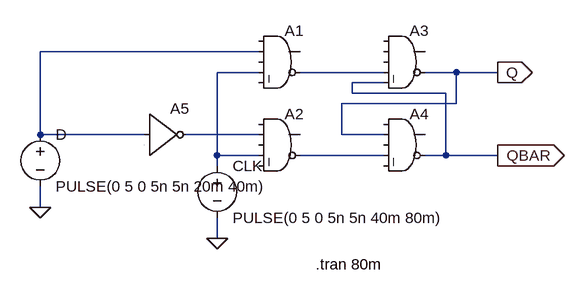
[diagram p0: schematic DFFUSINGNAND.asc]
DFFUSINGNAND.asc, the LTspice schematic file:
Version 4
SHEET 1 880 680
WIRE 208 64 -128 64
WIRE 208 96 144 96
WIRE 400 96 272 96
WIRE 512 96 464 96
WIRE 576 96 512 96
WIRE 400 112 352 112
WIRE 352 128 352 112
WIRE 496 128 352 128
WIRE 512 144 512 96
WIRE 512 144 336 144
WIRE -128 192 -128 64
WIRE 32 192 -128 192
WIRE 208 192 96 192
WIRE 336 192 336 144
WIRE 400 192 336 192
WIRE 144 224 144 96
WIRE 208 224 144 224
WIRE 400 224 272 224
WIRE 496 224 496 128
WIRE 496 224 464 224
WIRE 576 224 496 224
WIRE 144 240 144 224
WIRE -128 304 -128 272
WIRE 144 352 144 320
FLAG -128 304 0
FLAG 144 352 0
FLAG 576 96 Q
IOPIN 576 96 Out
FLAG 576 224 QBAR
IOPIN 576 224 Out
SYMBOL Digital\\and 240 16 R0
SYMATTR InstName A1
SYMBOL Digital\\and 240 144 R0
SYMATTR InstName A2
SYMBOL Digital\\and 432 16 R0
SYMATTR InstName A3
SYMBOL Digital\\and 432 144 R0
SYMATTR InstName A4
SYMBOL Digital\\inv 32 128 R0
SYMATTR InstName A5
SYMBOL voltage -128 176 R0
WINDOW 123 0 0 Left 0
WINDOW 39 0 0 Left 0
SYMATTR InstName D
SYMATTR Value PULSE(0 5 0 5n 5n 20m 40m)
SYMBOL voltage 144 224 R0
WINDOW 123 0 0 Left 0
WINDOW 39 0 0 Left 0
SYMATTR InstName CLK
SYMATTR Value PULSE(0 5 0 5n 5n 40m 80m)
TEXT 296 392 Left 2 !.tran 80m

The netlist it stands for:
* DFFUSINGNAND.asc
A1 0 N001 0 N002 0 N003 0 0 AND
A2 0 N004 0 N002 0 N005 0 0 AND
A3 0 0 0 N003 QBAR Q 0 0 AND
A4 0 Q 0 N005 0 QBAR 0 0 AND
A5 N001 0 0 0 0 N004 0 0 BUF
V§D N001 0 PULSE(0 5 0 5n 5n 20m 40m)
V§CLK N002 0 PULSE(0 5 0 5n 5n 40m 80m)
.tran 80m
.backanno
.end